# Altium schematic sheet SWD.SchDoc
size A; SheetNumber: 7; SheetTotal: 17
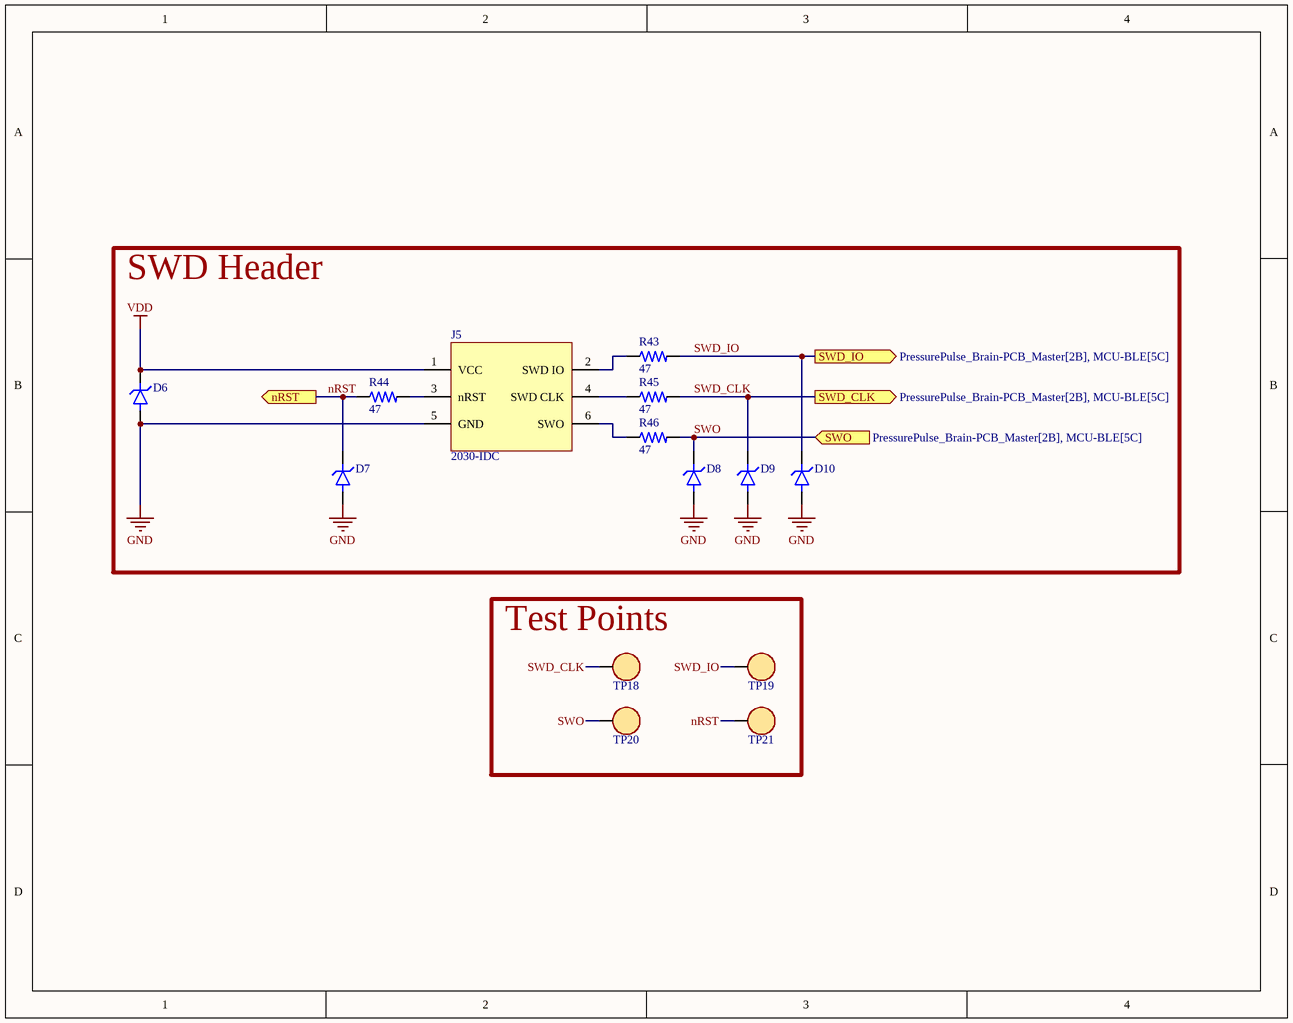
[diagram p0: SWD.SchDoc]

## Parts
D6  RCLAMP0521P.TCT  [BDFN2C051V40]  (value not drawn)
D7  RCLAMP0521P.TCT  [BDFN2C051V40]  (value not drawn)
D8  RCLAMP0521P.TCT  [BDFN2C051V40]  (value not drawn)
D9  RCLAMP0521P.TCT  [BDFN2C051V40]  (value not drawn)
D10  RCLAMP0521P.TCT  [BDFN2C051V40]  (value not drawn)
J5  2030-IDC  [TAG CONNECT TC2030IDC - NO 3D MODEL]
R43  value 47  [0402R]  (hidden comment: RES)
R44  value 47  [0402R]  (hidden comment: RES)
R45  value 47  [0402R]  (hidden comment: RES)
R46  value 47  [0402R]  (hidden comment: RES)
TP18  RH-5019  [TP - RH-5019]  (value not drawn)
TP19  RH-5019  [TP - RH-5019]  (value not drawn)
TP20  RH-5019  [TP - RH-5019]  (value not drawn)
TP21  RH-5019  [TP - RH-5019]  (value not drawn)

## Blocks framed on the sheet
SWD Header: D6-D10 J5 R43-R46
Test Points: TP18-TP21

## Ports
nRST (out, see PressurePulse_Brain-PCB_Master[2B], MCU-BLE[4D]), SWD_CLK (out, see PressurePulse_Brain-PCB_Master[2B], MCU-BLE[5C]), SWD_IO (out, see PressurePulse_Brain-PCB_Master[2B], MCU-BLE[5C]), SWO (in, see PressurePulse_Brain-PCB_Master[2B], MCU-BLE[5C])

## Nets
GND: D6.A D7.A D8.A D9.A D10.A J5.5(GND)
VDD: D6.K J5.1(VCC)
nRST: D7.K R44.1 TP21.1 ; port nRST
SWD_CLK: D9.K R45.2 TP18.1 ; port SWD_CLK
SWD_IO: D10.K R43.2 TP19.1 ; port SWD_IO
SWO: D8.K R46.2 TP20.1 ; port SWO
NetJ5_2: J5.2(SWD_IO) R43.1
NetJ5_3: J5.3(nRST) R44.2
NetJ5_4: J5.4(SWD_CLK) R45.1
NetJ5_6: J5.6(SWO) R46.1

## Library data of the parts
D6-D10 = TVS DIODE: 25V Clamp 4A (8/20µs) Ipp Tvs Diode Surface Mount SLP1006P2; MFR: BORN; Type: SMD; Value: BDFN2C051V40; MFR PN: BDFN2C051V40; JLCPCB PN: C152023
J5 = TAG CONNECT 2030-IDC: MFR PN: TC2030-IDC; Value: DNS; MFR: Tag Connect
R43-R46 = RES: Resistor; MFR PN: *; MFR: *; JLCPCB PN: *
TP18-TP21 = TEST POINT: MFR: ronghe; MFR PN: RH-5019; Value: RH-5019; JLCPCB PN: C5199800